# EAGLE design power-supply_pos_v1 (EAGLE 6.4)

## Sheet 1 of 2: Positive
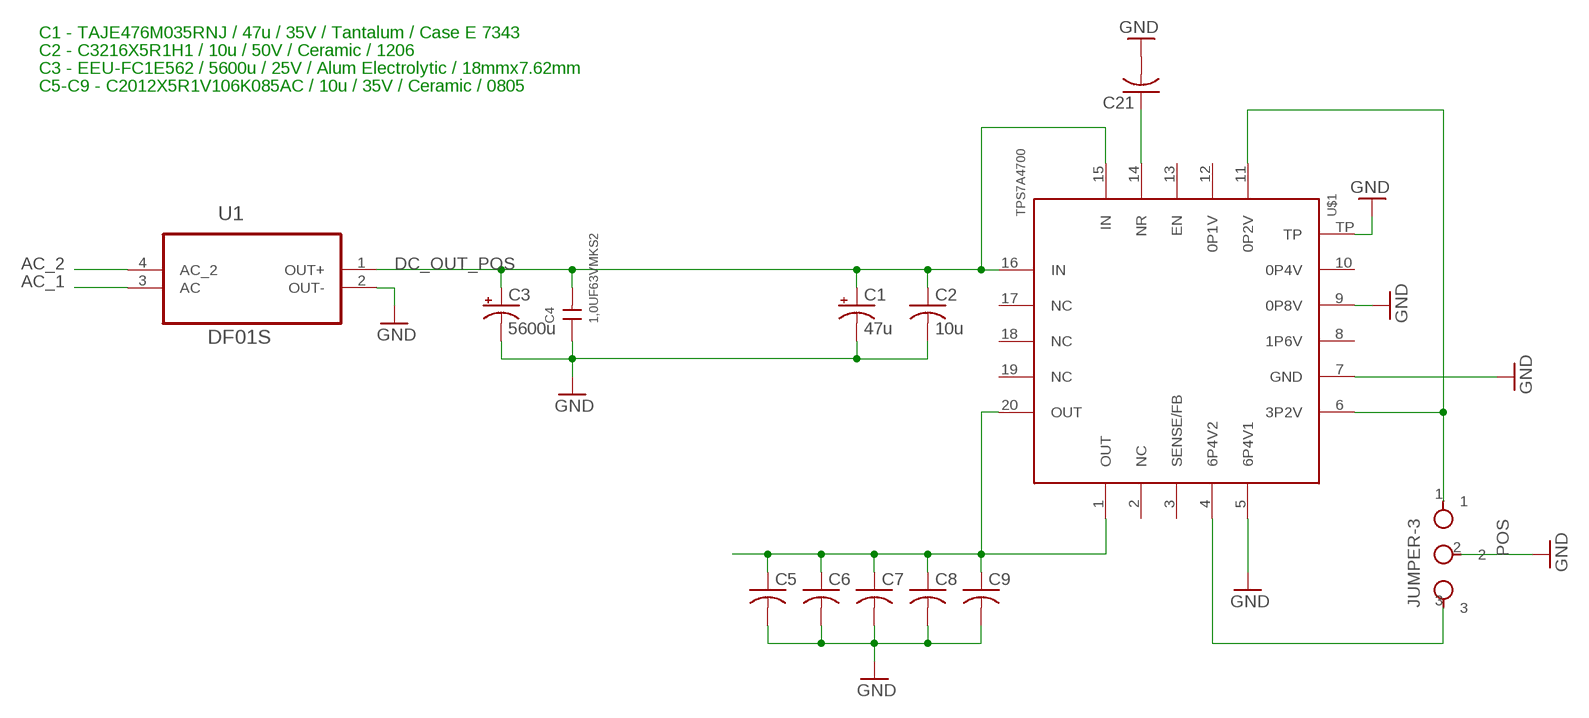
[diagram p0: schematic, sheet 1]

### Parts
C1  47u  CPOL-USSMCE  [SMC_E]
C2  10u  C-USC1206  [C1206]
C3  5600u  CPOL-USE7.5-18  [E7,5-18]
C4  1,0UF63VMKS2  [5,0X10,0RM5,0]
C5  C-USC0805  [C0805]
C6  C-USC0805  [C0805]
C7  C-USC0805  [C0805]
C8  C-USC0805  [C0805]
C9  C-USC0805  [C0805]
C21  C-USC0603  [C0603]
POS  JUMPER-3  [1X03]
U1  DF01S  [SOT508P985X260-4N]
U$1  TPS7A4700  [VQFN-20]

### Nets
AC_1: U1.3(AC)
AC_2: U1.4(AC_2)
DC_OUT_POS: C1.+ C2.1 C3.+ C4.2 U1.1(OUT+) U$1.15(IN) U$1.16(IN)
GND: C1.- C2.2 C3.- C4.1 C5.2 C6.2 C7.2 C8.2 C9.2 C21.2 POS.2 U1.2(OUT-) U$1.5(6P4V1) U$1.7(GND) U$1.9(0P8V) U$1.TP ; also sheet 2
N$2: POS.3 U$1.4(6P4V2)
N$3: POS.1 U$1.6(3P2V) U$1.11(0P2V)
N$5: C21.1 U$1.14(NR)
POS_OUT: C5.1 C6.1 C7.1 C8.1 C9.1 U$1.1(OUT) U$1.20(OUT)
Unconnected: U$1.2(NC) U$1.3(SENSE/FB) U$1.8(1P6V) U$1.10(0P4V) U$1.12(0P1V) U$1.13(EN) U$1.17(NC) U$1.18(NC) U$1.19(NC)

### Notes on the sheet
- C1 - TAJE476M035RNJ / 47u / 35V / Tantalum / Case E 7343
- C2 - C3216X5R1H1 / 10u / 50V / Ceramic / 1206
- C3 - EEU-FC1E562 / 5600u / 25V / Alum Electrolytic / 18mmx7.62mm
- C5-C9 - C2012X5R1V106K085AC / 10u / 35V / Ceramic / 0805

## Sheet 2 of 2: Negative
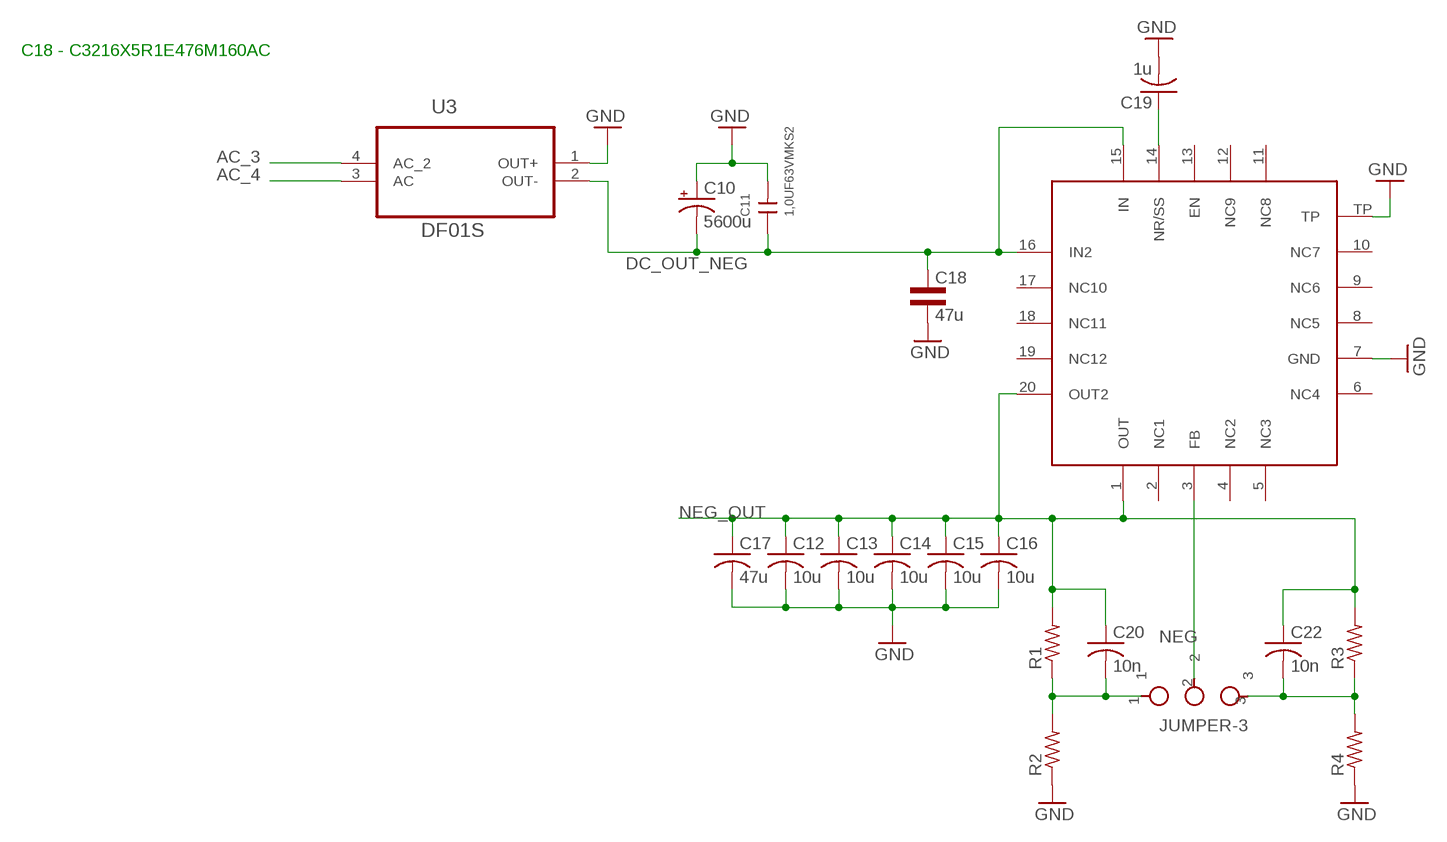
[diagram p1: schematic, sheet 2]

### Parts
C10  5600u  CPOL-USE7.5-18  [E7,5-18]
C11  1,0UF63VMKS2  [5,0X10,0RM5,0]
C12  10u  C-USC0805  [C0805]
C13  10u  C-USC0805  [C0805]
C14  10u  C-USC0805  [C0805]
C15  10u  C-USC0805  [C0805]
C16  10u  C-USC0805  [C0805]
C17  47u  C-USC2220K  [C2220K]
C18  47u  CAP1206L3  [1206L3]
C19  1u  C-USC0603  [C0603]
C20  10n  C-USC0603  [C0603]
C22  10n  C-USC0603  [C0603]
NEG  JUMPER-3  [1X03]
R1  R-US_R0603  [R0603]
R2  R-US_R0603  [R0603]
R3  R-US_R0603  [R0603]
R4  R-US_R0603  [R0603]
U3  DF01S  [SOT508P985X260-4N]
U$2  TPS7A3301RGWT  [VQFN-20]

### Nets
AC_3: U3.4(AC_2)
AC_4: U3.3(AC)
DC_OUT_NEG: C10.- C11.1 C18.1 U3.2(OUT-) U$2.15(IN) U$2.16(IN2)
GND: C10.+ C11.2 C12.2 C13.2 C14.2 C15.2 C16.2 C17.2 C18.2 C19.2 R2.1 R4.1 U3.1(OUT+) U$2.7(GND) U$2.TP ; also sheet 1
N$4: C20.2 NEG.1 R1.1 R2.2
N$6: C19.1 U$2.14(NR/SS)
N$9: C22.2 NEG.3 R3.1 R4.2
N$10: NEG.2 U$2.3(FB)
NEG_OUT: C12.1 C13.1 C14.1 C15.1 C16.1 C17.1 C20.1 C22.1 R1.2 R3.2 U$2.1(OUT) U$2.20(OUT2)
Unconnected: U$2.2(NC1) U$2.4(NC2) U$2.5(NC3) U$2.6(NC4) U$2.8(NC5) U$2.9(NC6) U$2.10(NC7) U$2.11(NC8) U$2.12(NC9) U$2.13(EN) U$2.17(NC10) U$2.18(NC11) U$2.19(NC12)

### Notes on the sheet
- C18 - C3216X5R1E476M160AC

## Library data of the parts
C1 C3 C10 = rcl:CPOL-US: POLARIZED CAPACITOR, American symbol
C2 C5-C9 C12-C17 C19-C22 = rcl:C-US: CAPACITOR, American symbol
C4 C11 = wima_c:1,0UF63V
C18 = common:CAP
NEG POS = pinhead:JUMPER-3
R1-R4 = rcl:R-US_: RESISTOR, American symbol
U1 U3 = Fairchild_By_element14_Batch_1:DF01S: Bridge Rectifiers; MPN: DF01S; OC_FARNELL: 1470959; OC_NEWARK: 84K0208; PACKAGE: SDIP-4; SUPPLIER: Fairchild
U$1 = ti_ldo:TPS7A4700
U$2 = ti_ldo:TPS7A3301RGWT: Ultra-Low Noise NEGATIVE Voltage Reglator

## Board
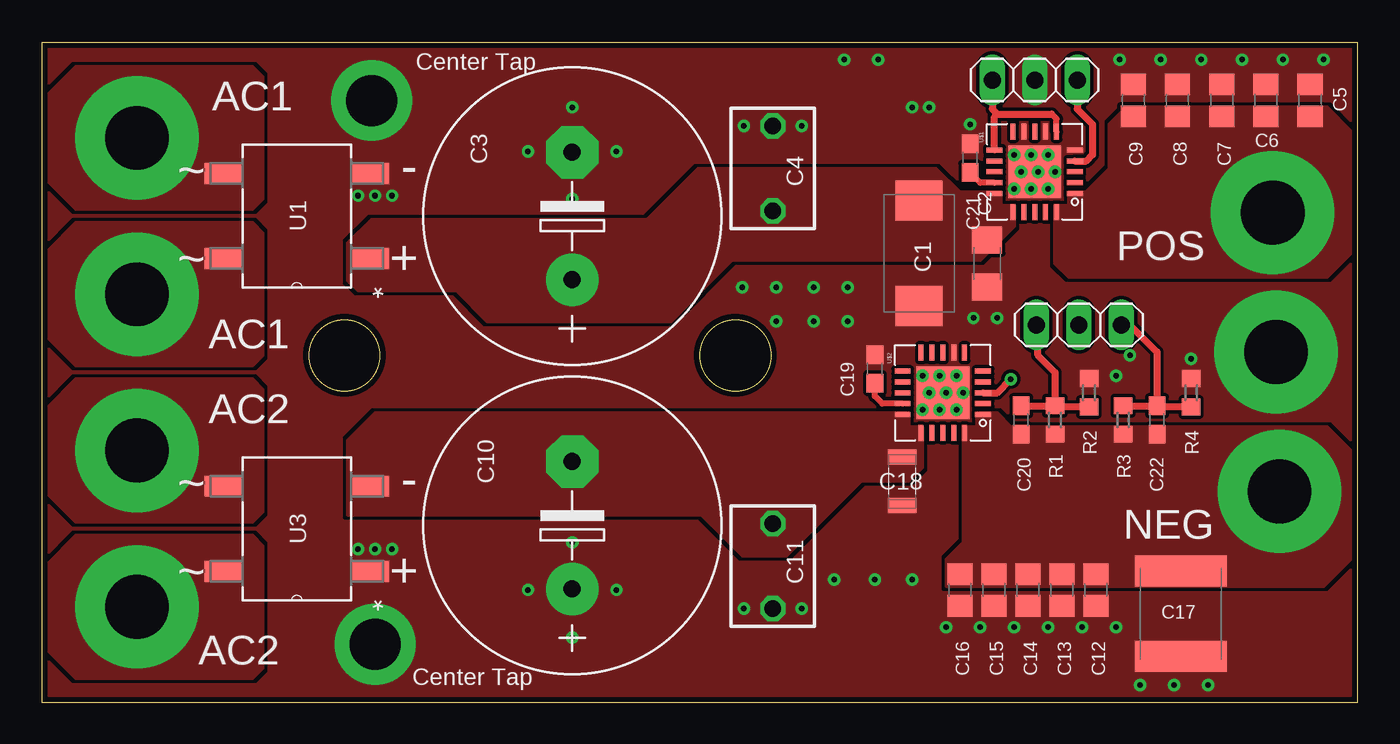
[diagram p2: board, top side]
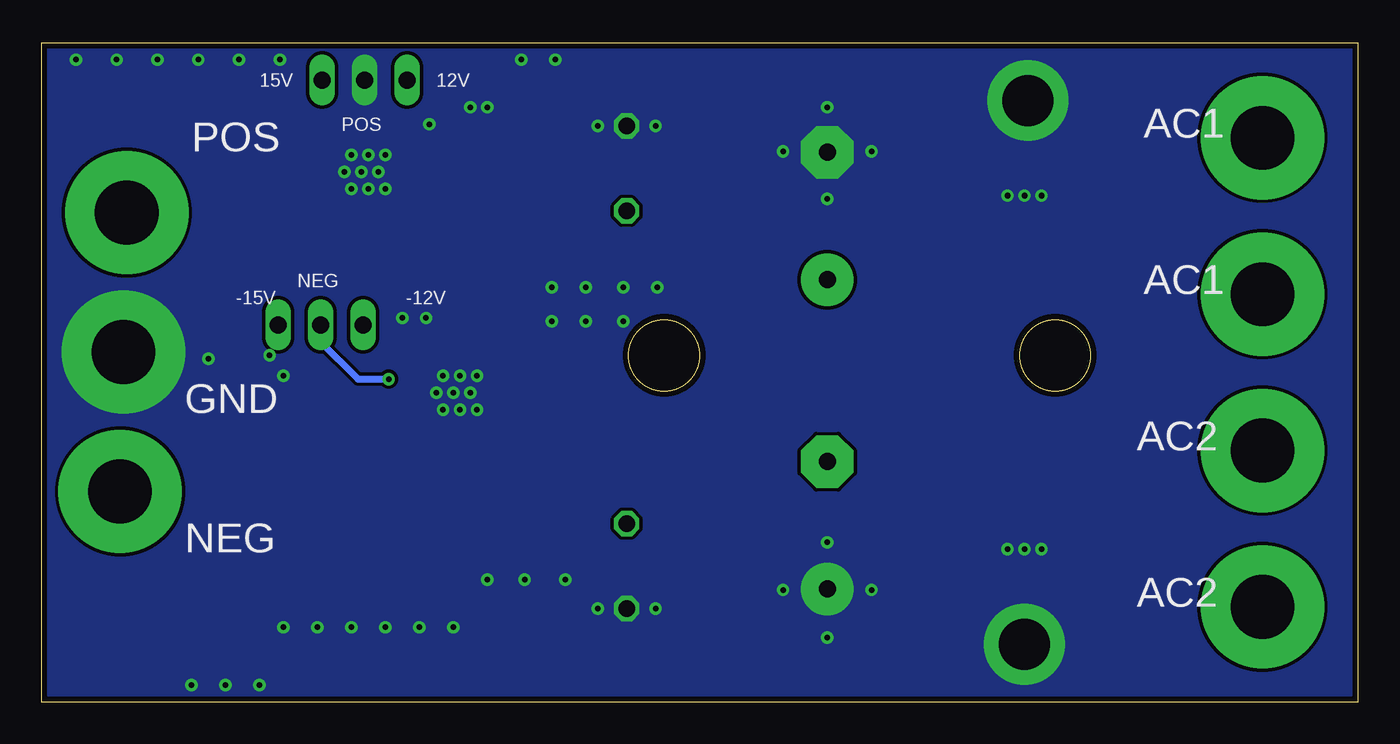
[diagram p3: board, bottom side, seen from below]

Size 78.64 x 39.42 mm. Coordinates in mm from the lower left corner, seen from the top.
Outline: 0,0 78.64,0 78.64,39.42 0,39.42 0,0
Outline: circle at 18.08,20.73 radius 2.12
Outline: circle at 41.45,20.73 radius 2.12
Copper layers (1*16): Top 0.035mm / dielectric 1.5mm / Bottom 0.035mm
Design rules "default *": minimum track width 10mil, minimum drill 24mil, track to track 8mil, track to pad 8mil, pad to pad 8mil, via to via 8mil, smd to smd 8mil, copper to edge 13mil, drill to drill 8mil, minimum pad ring 10mil, minimum via ring 8mil, stop-mask expansion 4mil, vias tented up to drill 14mil, thermal gap 10mil

### Footprints (pad centres in the part's own frame; a part is rotated, then mirrored left to right if it is on the bottom)
SMC_E = smd 2.4 x 2.8: + -3.15,0; - 3.15,0
C1206 = smd 1.6 x 1.8: 1 -1.4,0; 2 1.4,0
E7,5-18 = drill 1.016 pad 3.15: + -3.81,0 | drill 1.016 pad 3.15 octagon: - 3.81,0
5,0X10,0RM5,0 = drill 1 pad 1.5 octagon: 1 -2.54,0; 2 2.54,0
C0805 = smd 1.3 x 1.5: 1 -0.95,0; 2 0.95,0
C2220K = smd 1.85 x 5.5: 1 -2.55,0; 2 2.55,0
1206L3 = smd 0.9 x 1.7: 1 -1.45,0; 2 1.45,0
C0603 = smd 1.1 x 1: 1 -0.85,0; 2 0.85,0
1X03 = drill 1.016 long: 1 -2.54,0; 2 0,0; 3 2.54,0
R0603 = smd 1 x 1.1: 1 -0.85,0; 2 0.85,0
SOT508P985X260-4N = smd 2.235 x 1.245: 1 -4.394,2.54; 2 -4.394,-2.54; 3 4.394,-2.54; 4 4.394,2.54
VQFN-20 = smd 0.3 x 0.95: 1 -1.3,-2.4; 2 -0.65,-2.4; 3 0,-2.4; 4 0.65,-2.4; 5 1.3,-2.4; 11 1.3,2.4; 12 0.65,2.4; 13 0,2.4; 14 -0.65,2.4; 15 -1.3,2.4 | smd 0.95 x 0.3: 6 2.4,-1.3; 7 2.4,-0.65; 8 2.4,0; 9 2.4,0.65; 10 2.4,1.3; 16 -2.4,1.3; 17 -2.4,0.65; 18 -2.4,0; 19 -2.4,-0.65; 20 -2.4,-1.3 | smd 3.15 x 3.15: TP 0,0

### Placement (x,y rotation side)
C1  52.43,26.82 270 top
C2  56.49,26.21 270 top
C3  31.7,29.06 90 top
C4  43.69,31.9 270 top
C5  75.79,35.97 90 top
C6  73.15,35.97 90 top
C7  70.51,35.97 90 top
C8  67.87,35.97 90 top
C9  65.23,35.97 90 top
C10  31.7,10.57 90 top
C11  43.69,8.13 270 top
C12  62.99,6.71 270 top
C13  60.96,6.71 270 top
C14  58.93,6.71 270 top
C15  56.9,6.71 270 top
C16  54.86,6.71 270 top
C17  68.07,5.28 270 top
C18  51.41,13.21 270 top
C19  49.78,19.91 90 top
C20  58.52,16.87 90 top
C21  55.47,32.51 90 top
C22  66.65,16.87 90 top
NEG  61.98,22.56 0 top
POS  59.33,37.19 0 top
R1  60.55,16.87 270 top
R2  62.59,18.49 270 top
R3  64.62,16.87 270 top
R4  68.68,18.49 270 top
U1  15.24,29.06 180 top
U3  15.24,10.36 180 top
U$1  59.33,31.7 90 top
U$2  53.85,18.49 90 top

### Tracks (layer width: path | path; a pad name or v marks a point on that pad's centre or on a via)
AC_1  (via drill 3.81 pad 7.37)
  other vias: 5.69,33.73
  pour Top (no thermals): 12.6,29.46 2.03,29.46 0.41,31.09 0.41,36.37 2.03,38 12.6,38 13.21,37.39 13.21,30.07
AC_2  (via drill 3.81 pad 7.37)
  other vias: 5.69,24.38
  pour Top (no thermals): 12.6,20.12 2.03,20.12 0.41,21.74 0.41,27.03 2.03,28.65 12.6,28.65 13.21,28.04 13.21,20.73
AC_3  (via drill 3.81 pad 7.37)
  other vias: 5.69,5.69
  pour Top (no thermals): 12.6,9.96 2.03,9.96 0.41,8.33 0.41,3.05 2.03,1.42 12.6,1.42 13.21,2.03 13.21,9.35
AC_4  (via drill 3.81 pad 7.37)
  other vias: 5.69,15.04
  pour Top (no thermals): 12.6,19.3 2.03,19.3 0.41,17.68 0.41,12.4 2.03,10.77 12.6,10.77 13.21,11.38 13.21,18.69
DC_OUT_NEG
  pour Top (no thermals): 18.29,11.18 39.42,11.18 41.86,8.74 44.5,8.74 48.97,13.21 51.82,13.21 52.63,14.02 52.63,16.46 51.82,16.46 51.82,17.27 19.91,17.27 18.29,15.65
DC_OUT_POS
  pour Top (no thermals): 18.9,24.59 24.79,24.59 26.62,22.76 37.59,22.76 41.25,26.42 56.08,26.42 58.12,28.45 58.12,29.67 57.3,29.67 57.3,30.48 54.86,30.48 53.44,31.9 39.22,31.9 36.17,28.85 19.71,28.85 18.29,27.43 18.29,25.2
GND  (via drill 0.33, 3.05 pad 4.83, 3.81 pad 7.37)
  other vias: 19.71,35.97 19.91,3.45 58.12,32.72 59.13,32.72 60.15,32.72 60.55,31.7 59.54,31.7 58.52,31.7 58.12,30.68 59.13,30.68 60.15,30.68 52.63,19.51 53.64,19.51 54.66,19.51 55.07,18.49 54.05,18.49 53.04,18.49 52.63,17.48 53.64,17.48 54.66,17.48 54.05,4.47 56.08,4.47 58.12,4.47 60.15,4.47 62.18,4.47 64.21,4.47 65.63,1.02 67.67,1.02 69.7,1.02 47.35,7.32 49.78,7.32 52.02,7.32 18.9,30.28 19.91,30.28 20.93,30.28 18.9,9.14 19.91,9.14 20.93,9.14 31.7,3.86 31.7,35.56 34.34,32.92 29.06,32.92 31.7,30.07 34.34,6.71 29.06,6.71 31.7,9.55 41.96,34.44 45.42,34.44 45.42,5.59 41.96,5.59 76.61,38.4 74.17,38.4 71.73,38.4 69.29,38.4 66.85,38.4 64.41,38.4 52.02,35.56 53.04,35.56 64.21,19.51 55.47,34.54 68.68,20.52 47.96,38.4 49.99,38.4 65.02,20.73 41.86,24.79 43.89,24.79 43.89,22.76 57.1,22.96 55.68,22.96 46.13,24.79 46.13,22.76 48.16,24.79 48.16,22.76 73.76,20.93
  pour Top (rank 6, no thermals): 0.41,39.01 78.23,39.01 78.23,0.41 0.41,0.41
  pour Bottom (rank 6, no thermals): 0.41,39.01 78.23,39.01 78.23,0.41 0.41,0.41
N$2
  Top 0.406: POS.3 61.87,35.46 62.79,34.54 62.79,32.72 62.42,32.35 U$1.4
N$3
  Top 0.356: U$1.6 60.63,34.87 60.35,35.15
  Top 0.406: POS.1 56.79,35.46 57.1,35.15 | 57.1,35.15 60.35,35.15 | U$1.11 56.93,34.99 57.1,35.15
N$4
  Top 0.406: C20.2 R1.1 | R2.2 60.63,17.64 R1.1 | R1.1 60.55,19.71 59.54,20.73 59.54,22.45 NEG.1
N$5
  Top 0.356: U$1.14 56.09,31.05 C21.1
N$6
  Top 0.356: U$2.14 50.23,17.84 49.78,18.29 C19.1
N$9
  Top 0.406: NEG.3 65.02,22.56 66.65,20.93 C22.2 | R3.1 C22.2 | R4.2 66.72,17.64 C22.2
N$10  (via drill 0.33)
  Top 0.406: U$2.3 57.1,18.49 v57.91,19.3
  Bottom 0.406: v57.91,19.3 59.74,19.3 61.98,21.54 NEG.2
NEG_OUT  (via drill 3.81 pad 7.37)
  other vias: 73.96,12.6
  pour Top (no thermals): 55.07,16.46 55.07,9.55 54.05,8.53 54.05,6.91 76.61,6.91 78.23,8.53 78.23,15.04 76.81,16.46 57.91,16.46 57.1,17.27 55.88,17.27 55.88,16.46
POS_OUT  (via drill 3.81 pad 7.37)
  other vias: 73.56,29.26
  pour Top (no thermals): 60.55,29.67 60.55,26.21 61.37,25.4 76.81,25.4 78.23,26.82 78.23,34.14 76.81,35.56 64.82,35.56 63.8,34.54 63.8,31.9 62.38,30.48 61.37,30.48 61.37,29.67

### Text on the board
tPlace: Center Tap | AC1 | POS | AC1 | AC2 | NEG | AC2 | Center Tap
bPlace: 12V | 15V | AC1 | POS | AC1 | -12V | -15V | GND | AC2 | NEG | AC2